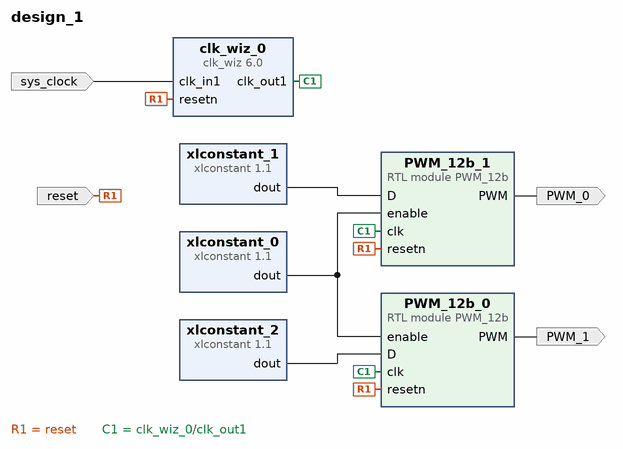
[diagram p0: block diagram of the top level]
# Vivado block design design_1, xc7a35ticsg324-1L, Vivado 2018.2
create_bd_design design_1

create_bd_port -dir I -type clk sys_clock
set_property -dict {CONFIG.FREQ_HZ 100000000 CONFIG.PHASE 0.000} [get_bd_ports sys_clock]
create_bd_port -dir I -type rst reset
set_property -dict {CONFIG.POLARITY ACTIVE_LOW} [get_bd_ports reset]
create_bd_port -dir O PWM_0
create_bd_port -dir O PWM_1

create_bd_cell -type ip -vlnv xilinx.com:ip:clk_wiz:6.0 clk_wiz_0
set_property -dict [list \
  CONFIG.CLKOUT1_REQUESTED_OUT_FREQ 430 \
  CONFIG.CLKOUT1_DRIVES BUFGCE \
  CONFIG.CLKOUT2_DRIVES BUFGCE \
  CONFIG.CLKOUT3_DRIVES BUFGCE \
  CONFIG.CLKOUT4_DRIVES BUFGCE \
  CONFIG.CLKOUT5_DRIVES BUFGCE \
  CONFIG.CLKOUT6_DRIVES BUFGCE \
  CONFIG.CLKOUT7_DRIVES BUFGCE \
  CONFIG.FEEDBACK_SOURCE FDBK_AUTO \
  CONFIG.RESET_PORT resetn \
  CONFIG.MMCM_DIVCLK_DIVIDE 5 \
  CONFIG.MMCM_CLKFBOUT_MULT_F 48.375 \
  CONFIG.MMCM_CLKOUT0_DIVIDE_F 2.250 \
  CONFIG.RESET_TYPE ACTIVE_LOW \
  CONFIG.USE_SAFE_CLOCK_STARTUP true \
  CONFIG.USE_BOARD_FLOW true \
  CONFIG.CLK_IN1_BOARD_INTERFACE sys_clock \
  CONFIG.RESET_BOARD_INTERFACE reset \
  CONFIG.CLKOUT1_JITTER 202.659 \
  CONFIG.CLKOUT1_PHASE_ERROR 298.409 \
] [get_bd_cells clk_wiz_0]
create_bd_cell -type ip -vlnv xilinx.com:ip:xlconstant:1.1 xlconstant_0
create_bd_cell -type ip -vlnv xilinx.com:ip:xlconstant:1.1 xlconstant_1
set_property -dict {CONFIG.CONST_WIDTH 12 CONFIG.CONST_VAL 1000} [get_bd_cells xlconstant_1]
create_bd_cell -type ip -vlnv xilinx.com:ip:xlconstant:1.1 xlconstant_2
set_property -dict {CONFIG.CONST_WIDTH 12 CONFIG.CONST_VAL 3000} [get_bd_cells xlconstant_2]
create_bd_cell -type module -reference PWM_12b PWM_12b_0
create_bd_cell -type module -reference PWM_12b PWM_12b_1

# ---- connections ----

connect_bd_net [get_bd_ports sys_clock] [get_bd_pins clk_wiz_0/clk_in1]
connect_bd_net [get_bd_ports reset] [get_bd_pins clk_wiz_0/resetn] [get_bd_pins PWM_12b_0/resetn] [get_bd_pins PWM_12b_1/resetn]
connect_bd_net [get_bd_pins clk_wiz_0/clk_out1] [get_bd_pins PWM_12b_0/clk] [get_bd_pins PWM_12b_1/clk]
connect_bd_net [get_bd_pins xlconstant_0/dout] [get_bd_pins PWM_12b_0/enable] [get_bd_pins PWM_12b_1/enable]
connect_bd_net [get_bd_pins xlconstant_1/dout] [get_bd_pins PWM_12b_1/D]
connect_bd_net [get_bd_pins xlconstant_2/dout] [get_bd_pins PWM_12b_0/D]
connect_bd_net [get_bd_pins PWM_12b_1/PWM] [get_bd_ports PWM_0]
connect_bd_net [get_bd_pins PWM_12b_0/PWM] [get_bd_ports PWM_1]

validate_bd_design
save_bd_design
